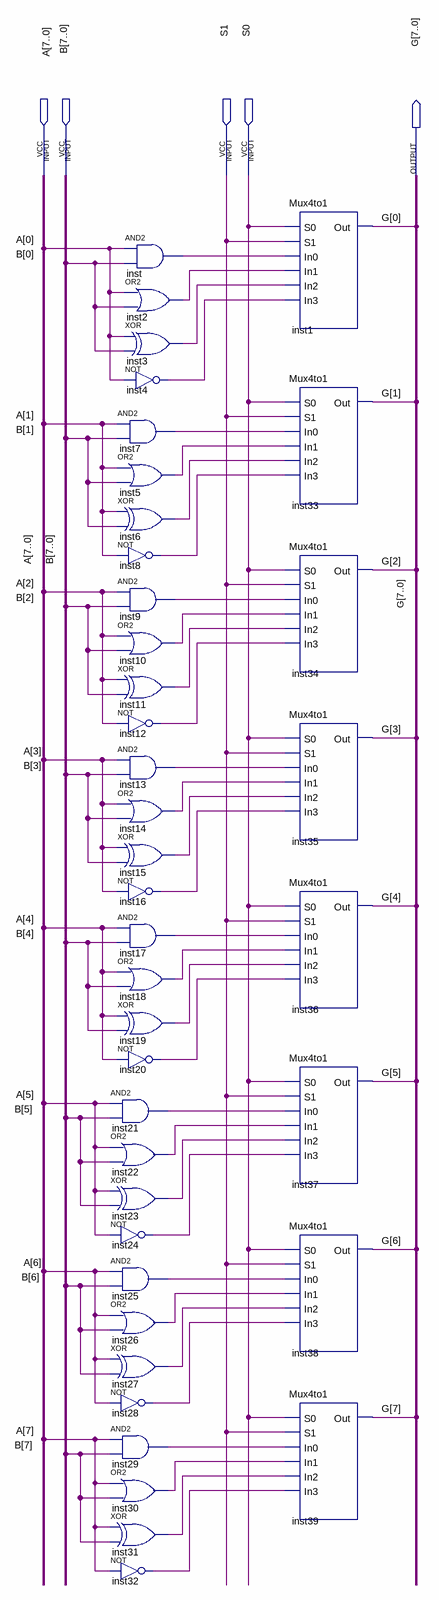
[diagram p0: schematic sheet]
// Quartus schematic LogicStage.bdf as structural Verilog: 40 symbols, 5 pins
module LogicStage (
  input  [7:0] A,
  input  [7:0] B,
  input  S1,
  input  S0,
  output [7:0] G
);

  wire inst2_out, inst3_out, inst4_out, inst5_out, inst6_out, inst7_out, inst8_out, inst9_out, inst10_out,
       inst11_out, inst12_out, inst13_out, inst14_out, inst15_out, inst16_out, inst17_out, inst18_out,
       inst19_out, inst20_out, inst21_out, inst22_out, inst23_out, inst24_out, inst25_out, inst26_out,
       inst27_out, inst28_out, inst29_out, inst30_out, inst31_out, inst32_out, inst_out;

  and inst (inst_out, A[0], B[0]);
  or inst2 (inst2_out, A[0], B[0]);
  xor inst3 (inst3_out, A[0], B[0]);
  not inst4 (inst4_out, A[0]);
  and inst7 (inst7_out, A[1], B[1]);
  or inst5 (inst5_out, A[1], B[1]);
  xor inst6 (inst6_out, A[1], B[1]);
  not inst8 (inst8_out, A[1]);
  and inst9 (inst9_out, A[2], B[2]);
  or inst10 (inst10_out, A[2], B[2]);
  xor inst11 (inst11_out, A[2], B[2]);
  not inst12 (inst12_out, A[2]);
  and inst13 (inst13_out, A[3], B[3]);
  or inst14 (inst14_out, A[3], B[3]);
  xor inst15 (inst15_out, A[3], B[3]);
  not inst16 (inst16_out, A[3]);
  and inst17 (inst17_out, A[4], B[4]);
  or inst18 (inst18_out, A[4], B[4]);
  xor inst19 (inst19_out, A[4], B[4]);
  not inst20 (inst20_out, A[4]);
  and inst21 (inst21_out, A[5], B[5]);
  or inst22 (inst22_out, A[5], B[5]);
  xor inst23 (inst23_out, A[5], B[5]);
  not inst24 (inst24_out, A[5]);
  and inst25 (inst25_out, A[6], B[6]);
  or inst26 (inst26_out, A[6], B[6]);
  xor inst27 (inst27_out, A[6], B[6]);
  not inst28 (inst28_out, A[6]);
  and inst29 (inst29_out, A[7], B[7]);
  or inst30 (inst30_out, A[7], B[7]);
  xor inst31 (inst31_out, A[7], B[7]);
  not inst32 (inst32_out, A[7]);
  Mux4to1 inst1 (.S0(S0), .S1(S1), .In0(inst_out), .In1(inst2_out), .In2(inst3_out), .In3(inst4_out), .Out(G[0]));
  Mux4to1 inst33 (.S0(S0), .S1(S1), .In0(inst7_out), .In1(inst5_out), .In2(inst6_out), .In3(inst8_out), .Out(G[1]));
  Mux4to1 inst34 (.S0(S0), .S1(S1), .In0(inst9_out), .In1(inst10_out), .In2(inst11_out), .In3(inst12_out), .Out(G[2]));
  Mux4to1 inst35 (.S0(S0), .S1(S1), .In0(inst13_out), .In1(inst14_out), .In2(inst15_out), .In3(inst16_out), .Out(G[3]));
  Mux4to1 inst36 (.S0(S0), .S1(S1), .In0(inst17_out), .In1(inst18_out), .In2(inst19_out), .In3(inst20_out), .Out(G[4]));
  Mux4to1 inst37 (.S0(S0), .S1(S1), .In0(inst21_out), .In1(inst22_out), .In2(inst23_out), .In3(inst24_out), .Out(G[5]));
  Mux4to1 inst38 (.S0(S0), .S1(S1), .In0(inst25_out), .In1(inst26_out), .In2(inst27_out), .In3(inst28_out), .Out(G[6]));
  Mux4to1 inst39 (.S0(S0), .S1(S1), .In0(inst29_out), .In1(inst30_out), .In2(inst31_out), .In3(inst32_out), .Out(G[7]));
endmodule
